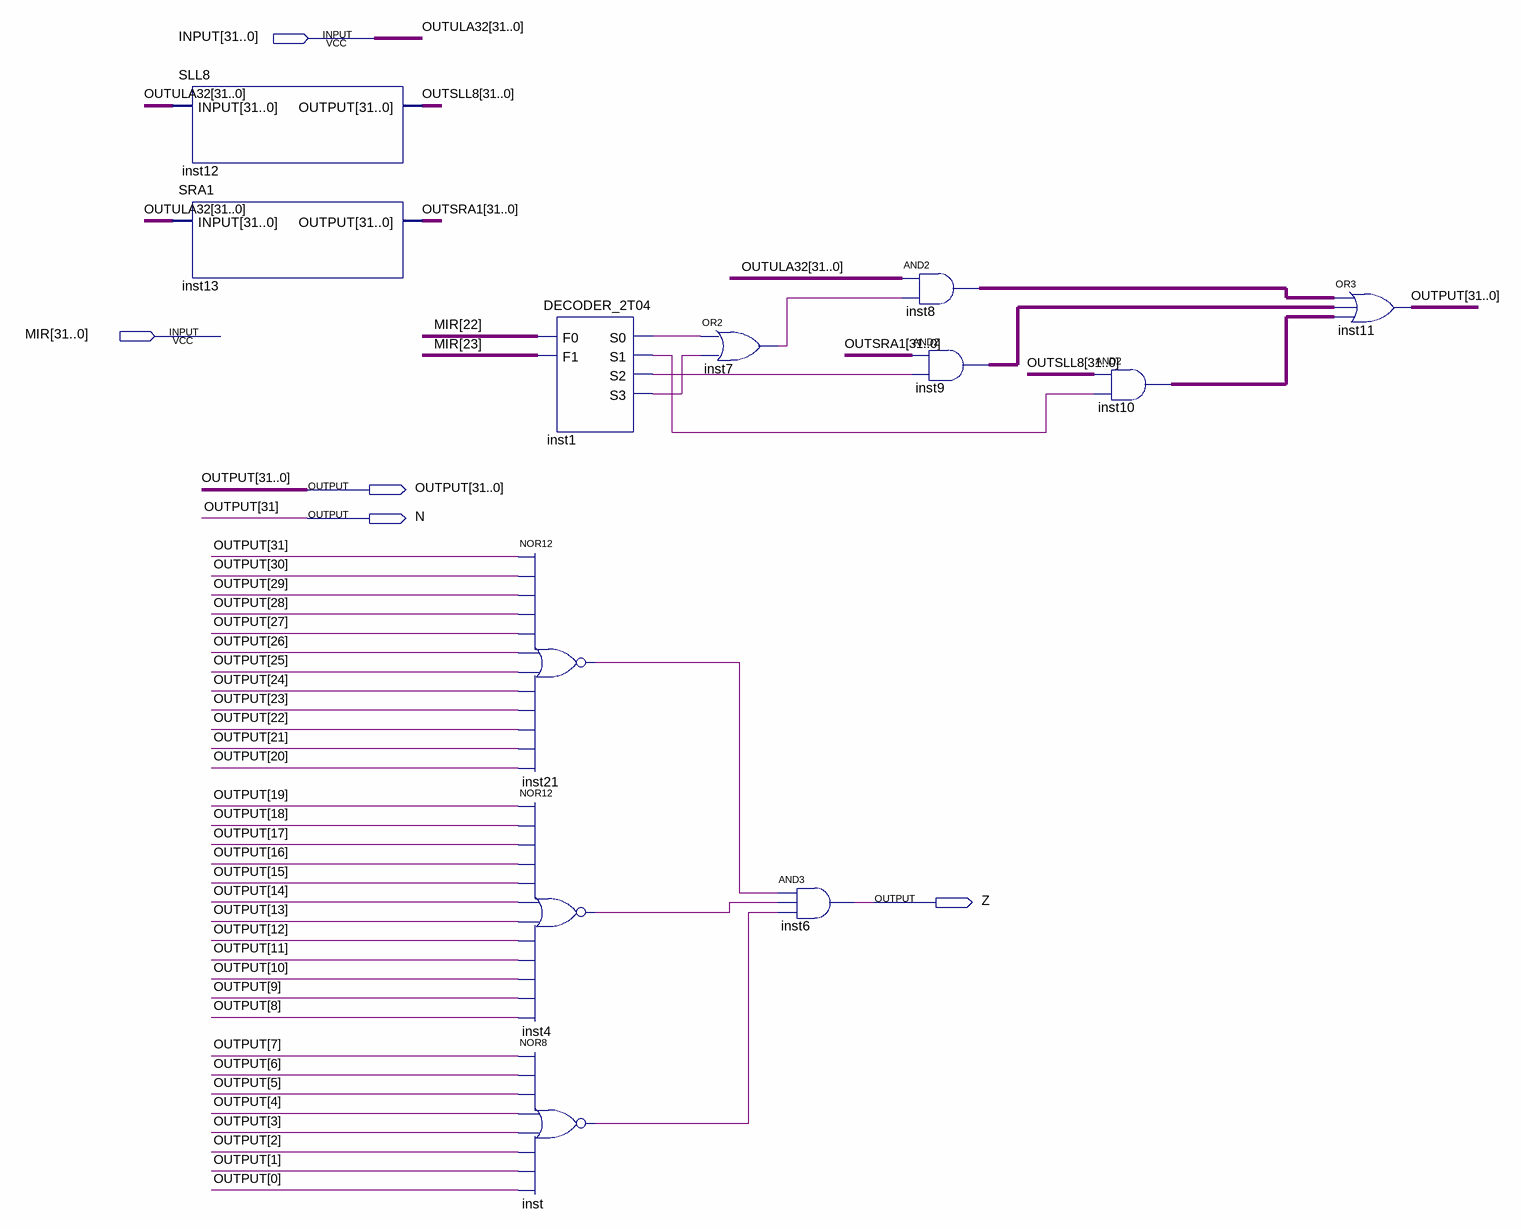
[diagram p0: schematic sheet]
// Quartus schematic SHIFTER.bdf as structural Verilog: 12 symbols, 5 pins
module SHIFTER (
  input  [31:0] INPUT,
  input  [31:0] MIR,
  output [31:0] OUTPUT,
  output N,
  output Z
);

  wire inst1_s0, inst1_s1, inst1_s2, inst1_s3, inst4_out, inst7_out, inst21_out, inst_out;
  wire [31:0] inst8_out, inst9_out, inst10_out, OUTSLL8, OUTSRA1;

  SLL8 inst12 (.INPUT(INPUT), .OUTPUT(OUTSLL8));
  SRA1 inst13 (.INPUT(INPUT), .OUTPUT(OUTSRA1));
  DECODER_2T04 inst1 (.F0(MIR[22]), .F1(MIR[23]), .S0(inst1_s0), .S1(inst1_s1), .S2(inst1_s2), .S3(inst1_s3));
  nor inst21 (inst21_out, N, OUTPUT[30], OUTPUT[29], OUTPUT[28], OUTPUT[27], OUTPUT[26], OUTPUT[25], OUTPUT[24], OUTPUT[23], OUTPUT[22], OUTPUT[21], OUTPUT[20]);
  nor inst4 (inst4_out, OUTPUT[19], OUTPUT[18], OUTPUT[17], OUTPUT[16], OUTPUT[15], OUTPUT[14], OUTPUT[13], OUTPUT[12], OUTPUT[11], OUTPUT[10], OUTPUT[9], OUTPUT[8]);
  nor inst (inst_out, OUTPUT[7], OUTPUT[6], OUTPUT[5], OUTPUT[4], OUTPUT[3], OUTPUT[2], OUTPUT[1], OUTPUT[0]);
  or inst7 (inst7_out, inst1_s0, inst1_s3);
  and inst6 (Z, inst21_out, inst4_out, inst_out);
  assign inst8_out = INPUT & {32{inst7_out}};  // AND2 inst8, 32 bits wide
  assign inst9_out = OUTSRA1 & {32{inst1_s2}};  // AND2 inst9, 32 bits wide
  assign inst10_out = OUTSLL8 & {32{inst1_s1}};  // AND2 inst10, 32 bits wide
  assign {N, OUTPUT[30:0]} = inst8_out | inst9_out | inst10_out;  // OR3 inst11, 32 bits wide

  assign OUTPUT[31] = N;

  // Other names for the same wires on the sheet: OUTULA32[31:0] = INPUT
endmodule
